# Altium schematic sheet microcontroller.SchDoc
size A
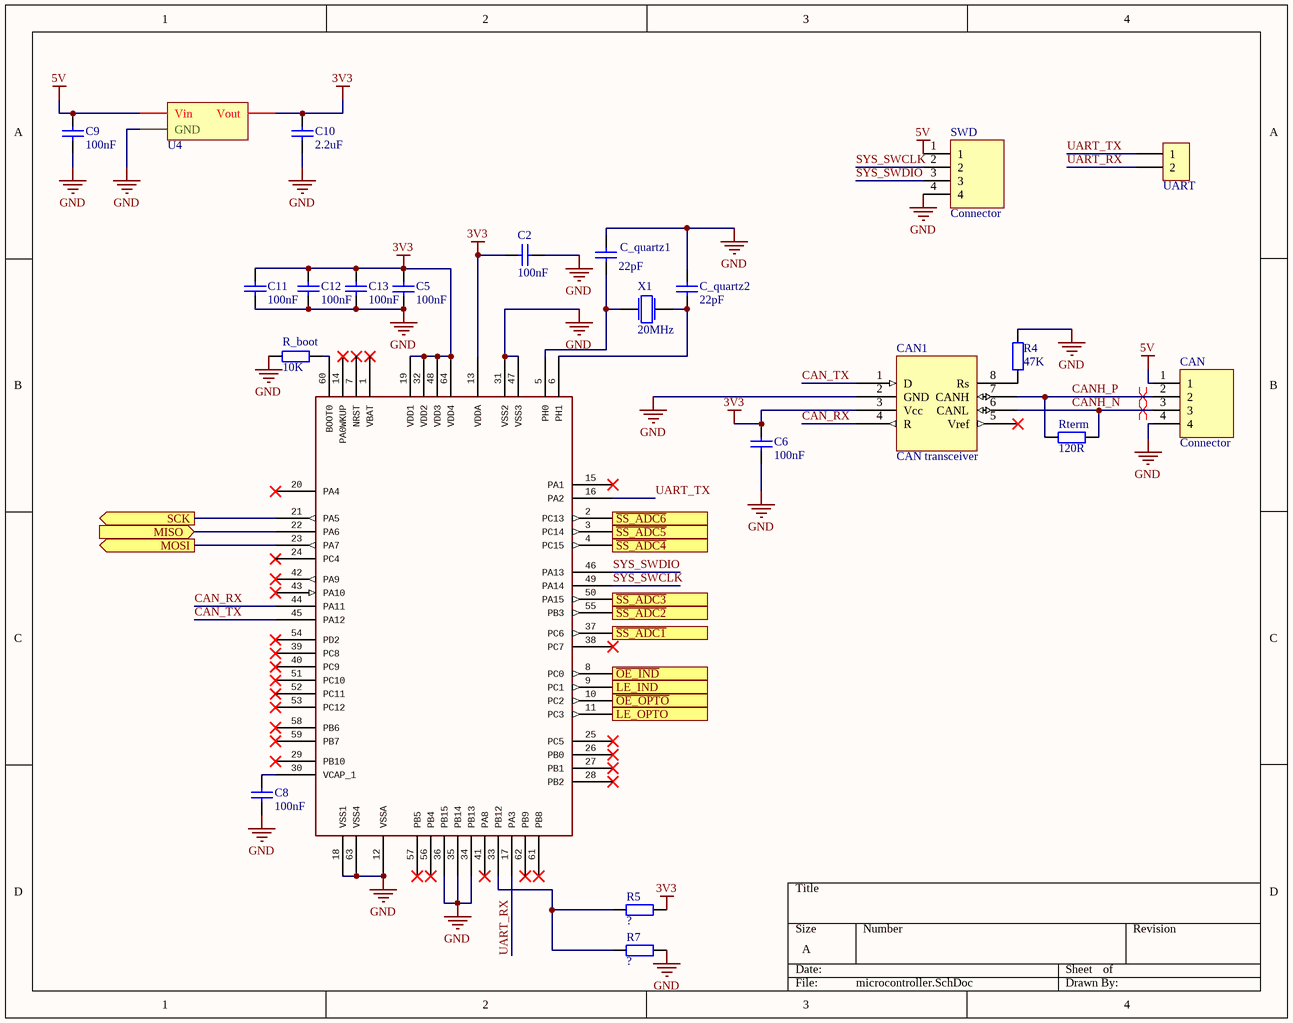
[diagram p0: microcontroller.SchDoc]

## Parts
1  64-pin STM32F4 chip with symbol for Foxcar Control Board v1.  [LQFP64]  (value not drawn)
C2  100nF  [FP_0805_CAP_085]
C5  100nF  [FP_0805_CAP_085]
C6  100nF  [FP_0805_CAP_085]
C8  100nF  [FP_0805_CAP_085]
C9  100nF  [FP_0805_CAP_085]
C10  2.2uF  [FP_0805_CAP_085]
C11  100nF  [FP_0805_CAP_085]
C12  100nF  [FP_0805_CAP_085]
C13  100nF  [FP_0805_CAP_085]
C_quartz1  22pF  [FP_0805_CAP_085]
C_quartz2  22pF  [FP_0805_CAP_085]
CAN  Connector  [FP_CONN4_TUSKE_254MM]
CAN1  CAN transceiver  [SOIC-8]
R4  47K  [FP_0805_RES]
R5  0Ohm  [FP_0805_RES]  (value not drawn)
R7  0Ohm  [FP_0805_RES]  (value not drawn)
R_boot  10K  [FP_0805_RES]
Rterm  120R  [FP_0805_RES]
SWD  Connector  [FP_CONN4_TUSKE_254MM]
U4  LF33CDT-TRY  [DPAK]  (value not drawn)
UART  2-Pin HEADER  [2-Pin Header]  (value not drawn)
X1  20MHz  [FP_CRYSTAL_HC49_SMD]

## Ports
LE_IND (out), LE_OPTO (out), MISO (in), MOSI (out), SCK (out), ~{OE_IND} (out), ~{OE_OPTO} (out), ~{SS_ADC1} (out), ~{SS_ADC2} (out), ~{SS_ADC3} (out), ~{SS_ADC4} (out), ~{SS_ADC5} (out), ~{SS_ADC6} (out)

## Nets
3V3: 1.13(VDDA) 1.19(VDD1) 1.32(VDD2) 1.48(VDD3) 1.64(VDD4) C2.2 C5.2 C6.1 C10.2 C11.2 C12.2 C13.2 CAN1.3(Vcc) R5.2 U4.S(Vout)
5V: C9.2 CAN.1 SWD.1 U4.G(Vin)
GND: 1.12(VSSA) 1.18(VSS1) 1.31(VSS2) 1.34(PB13) 1.35(PB14) 1.36(PB15) 1.47(VSS3) 1.63(VSS4) C2.1 C5.1 C6.2 C8.1 C9.1 C10.1 C11.1 C12.1 C13.1 C_quartz1.1 C_quartz2.1 CAN.4 CAN1.2(GND) R4.2 R7.2 R_boot.1 SWD.4 U4.D(GND)
CAN_RX: 1.44(PA11) CAN1.4(R)
CAN_TX: 1.45(PA12) CAN1.1(D)
CANH_N: CAN.3 CAN1.6(CANL) Rterm.2
CANH_P: CAN.2 CAN1.7(CANH) Rterm.1
LE_IND: 1.9(PC1) ; port LE_IND
LE_OPTO: 1.11(PC3) ; port LE_OPTO
MISO: 1.22(PA6) ; port MISO
MOSI: 1.23(PA7) ; port MOSI
~{OE_IND}: 1.8(PC0) ; port ~{OE_IND}
~{OE_OPTO}: 1.10(PC2) ; port ~{OE_OPTO}
~{SS_ADC1}: 1.37(PC6) ; port ~{SS_ADC1}
~{SS_ADC2}: 1.55(PB3) ; port ~{SS_ADC2}
~{SS_ADC3}: 1.50(PA15) ; port ~{SS_ADC3}
~{SS_ADC4}: 1.4(PC15) ; port ~{SS_ADC4}
~{SS_ADC5}: 1.3(PC14) ; port ~{SS_ADC5}
~{SS_ADC6}: 1.2(PC13) ; port ~{SS_ADC6}
SCK: 1.21(PA5) ; port SCK
SYS_SWCLK: 1.49(PA14) SWD.2
SYS_SWDIO: 1.46(PA13) SWD.3
UART_RX: 1.17(PA3) UART.2
UART_TX: 1.16(PA2) UART.1
Net1_5: 1.5(PH0) C_quartz1.2 X1.1
Net1_6: 1.6(PH1) C_quartz2.2 X1.2
Net1_30: 1.30(VCAP_1) C8.2
Net1_33: 1.33(PB12) R5.1 R7.1
Net1_60: 1.60(BOOT0) R_boot.2
NetCAN1_8: CAN1.8(Rs) R4.1

Not connected (* = marked no-connect by the designer): 1 1(VBAT)* 7(NRST)* 14(PA0WKUP)* 15(PA1)* 20(PA4)* 24(PC4)* 25(PC5)* 26(PB0)* 27(PB1)* 28(PB2)* 29(PB10)* 38(PC7)* 39(PC8)* 40(PC9)* 41(PA8)* 42(PA9)* 43(PA10)* 51(PC10)* 52(PC11)* 53(PC12)* 54(PD2)* 56(PB4)* 57(PB5)* 58(PB6)* 59(PB7)* 61(PB8)* 62(PB9)*; CAN1 5(Vref)*

## Layout directives
differential pair: CANH_N, CANH_P

## Library data of the parts
1 = STM32F4R_64PIN_FOXCAR: GateName_1: G$1; SymbolName_1: STM32F4_64PINS_FOXCARV1; LibraryName: stm32f4; DeviceSetName: STM32F4R_64PIN_FOXCAR; Package: LQFP64
C2 C5 C6 C8-C13 = CAP 100nF: Capacitor; Tolerance: +80%/-20%; Voltage: 25V; Reference: 1759167; Name: SMD Multilayer Ceramic Capacitor, 0805; Supplier: Farnell
  C2 C5 C6 C8 C9 C11-C13: Value: 100nF
  C10: Value: 2.2uF
C_quartz1 C_quartz2 = CAP 22pF: Capacitor; Tolerance: 5%; Voltage: 50V; Reference: 1759195; Name: SMD Multilayer Ceramic Capacitor, 0805; Supplier: Farnell; Value: 22pF
CAN SWD = Connector_4pin: 4pin Connector
CAN1 = SN65HVD230
R4 = RES 47K: Resistor; Tolerance: 5%; Power: 125mW; Name: YAGEO (PHYCOMP)  RC0805JR-0747KL  SMD Chip Resistor, Thick Film, 47 kohm; Reference: 9234217; Supplier: Farnell; Value: 47K
R5 R7 = RES: Resistor; Value: ?
R_boot = RES 10K: Resistor; Tolerance: 5%; Power: 125mW; Name: YAGEO (PHYCOMP)  RC0805JR-0710KL  SMD Chip Resistor, Thick Film, 10 kohm; Reference: 9234136; Supplier: Farnell; Value: 10K
Rterm = RES 120R: Resistor; Tolerance: 5%; Power: 125mW; Name: YAGEO (PHYCOMP)  RC0805JR-07120RL  SMD Chip Resistor, Thick Film, 120 ohm; Reference: 9233890; Supplier: Farnell; Value: 120R
U4 = LF33CDT-TRY: Linear Voltage Regulators VLDV Reg Inhibit 0.45V 50uA 500mA 3.3V
X1 = Crystal: Quarz Crystal; Value: 8MHz